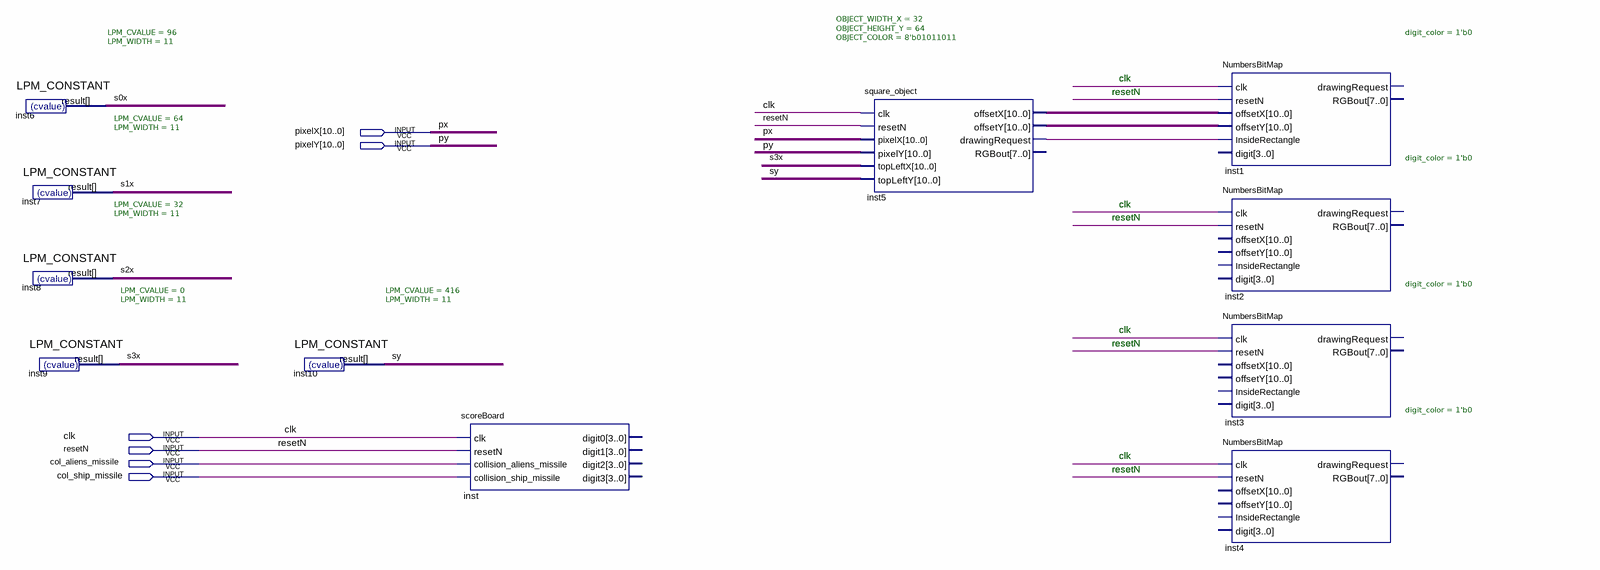
[diagram p0: schematic sheet]
// Quartus schematic score_Block.bdf as structural Verilog: 11 symbols, 6 pins
module score_Block (
  input  [10:0] pixelX,
  input  [10:0] pixelY,
  input  clk,
  input  resetN,
  input  col_aliens_missile,
  input  col_ship_missile
);

  wire inst5_drawingrequest, px, py, s0x, s1x, s2x, s3x, sy;
  wire [10:0] inst5_offsetx, inst5_offsety;

  LPM_CONSTANT #(.LPM_CVALUE(96), .LPM_WIDTH(11)) inst6 (.result(s0x));
  LPM_CONSTANT #(.LPM_CVALUE(64), .LPM_WIDTH(11)) inst7 (.result(s1x));
  LPM_CONSTANT #(.LPM_CVALUE(32), .LPM_WIDTH(11)) inst8 (.result(s2x));
  LPM_CONSTANT #(.LPM_CVALUE(0), .LPM_WIDTH(11)) inst9 (.result(s3x));
  LPM_CONSTANT #(.LPM_CVALUE(416), .LPM_WIDTH(11)) inst10 (.result(sy));
  scoreBoard inst (
    .clk(clk), .resetN(resetN), .collision_aliens_missile(col_aliens_missile),
    .collision_ship_missile(col_ship_missile));  // open: digit0, digit1, digit2, digit3
  square_object #(.OBJECT_WIDTH_X(32), .OBJECT_HEIGHT_Y(64), .OBJECT_COLOR(8'b01011011)) inst5 (
    .clk(clk), .resetN(resetN), .pixelX({11{px}}), .pixelY({11{py}}), .topLeftX({11{s3x}}),
    .topLeftY({11{sy}}), .offsetX(inst5_offsetx), .offsetY(inst5_offsety),
    .drawingRequest(inst5_drawingrequest));  // open: RGBout
  NumbersBitMap #(.digit_color(1'b0)) inst1 (
    .clk(clk), .resetN(resetN), .offsetX(inst5_offsetx), .offsetY(inst5_offsety),
    .InsideRectangle(inst5_drawingrequest));  // open: digit, drawingRequest, RGBout
  NumbersBitMap #(.digit_color(1'b0)) inst2 (
    .clk(clk), .resetN(resetN));  // open: offsetX, offsetY, InsideRectangle, digit, drawingRequest, RGBout
  NumbersBitMap #(.digit_color(1'b0)) inst3 (
    .clk(clk), .resetN(resetN));  // open: offsetX, offsetY, InsideRectangle, digit, drawingRequest, RGBout
  NumbersBitMap #(.digit_color(1'b0)) inst4 (
    .clk(clk), .resetN(resetN));  // open: offsetX, offsetY, InsideRectangle, digit, drawingRequest, RGBout

  // Notes on the sheet:
  //   clk
  //   resetN
  //   clk
  //   resetN
  //   clk
  //   resetN
  //   clk
  //   resetN
endmodule
